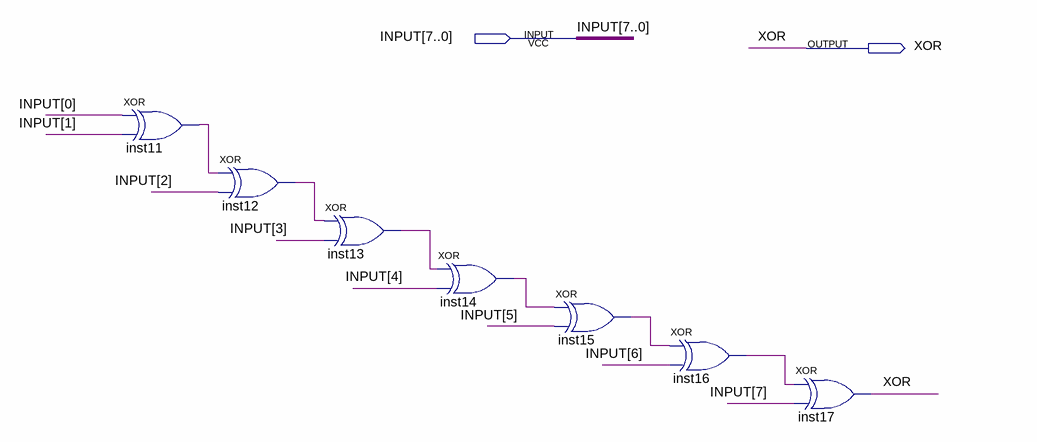
[diagram p0: schematic sheet]
// Quartus schematic XOOR.bdf as structural Verilog: 7 symbols, 2 pins
module XOOR (
  input  [7:0] INPUT,
  output XOR
);

  wire inst11_out, inst12_out, inst13_out, inst14_out, inst15_out, inst16_out;

  xor inst11 (inst11_out, INPUT[0], INPUT[1]);
  xor inst12 (inst12_out, inst11_out, INPUT[2]);
  xor inst13 (inst13_out, inst12_out, INPUT[3]);
  xor inst14 (inst14_out, inst13_out, INPUT[4]);
  xor inst15 (inst15_out, inst14_out, INPUT[5]);
  xor inst16 (inst16_out, inst15_out, INPUT[6]);
  xor inst17 (XOR, inst16_out, INPUT[7]);
endmodule
